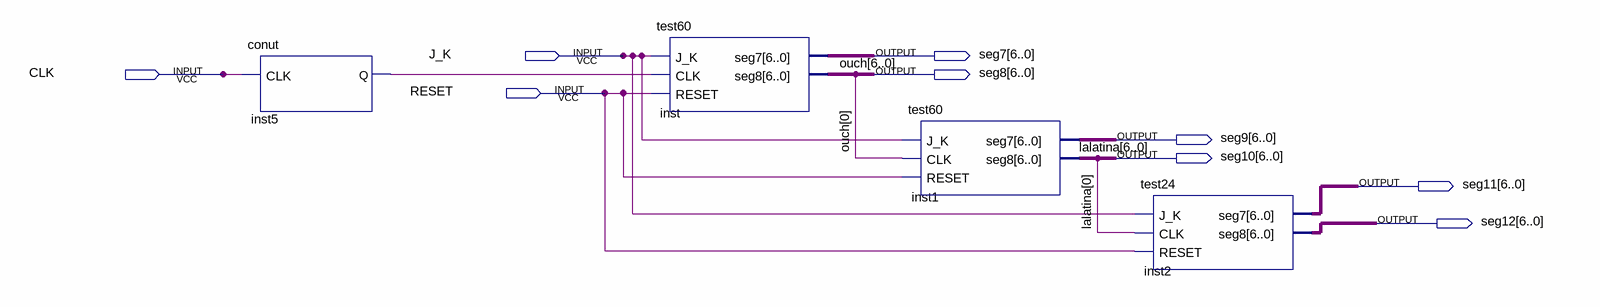
[diagram p0: schematic sheet]
// Quartus schematic clock_clock.bdf as structural Verilog: 4 symbols, 9 pins
module clock_clock (
  input  J_K,
  input  CLK,
  input  RESET,
  output [6:0] seg7,
  output [6:0] seg8,
  output [6:0] seg9,
  output [6:0] seg10,
  output [6:0] seg11,
  output [6:0] seg12
);

  wire inst5_q;

  conut inst5 (.CLK(CLK), .Q(inst5_q));
  test60 inst (.J_K(J_K), .CLK(inst5_q), .RESET(RESET), .seg7(seg7), .seg8(seg8));
  test60 inst1 (.J_K(J_K), .CLK(seg8[0]), .RESET(RESET), .seg7(seg9), .seg8(seg10));
  test24 inst2 (.J_K(J_K), .CLK(seg10[0]), .RESET(RESET), .seg7(seg11), .seg8(seg12));

  // Other names for the same wires on the sheet: lalatina[6:0] = seg10; ouch[6:0] = seg8
endmodule
